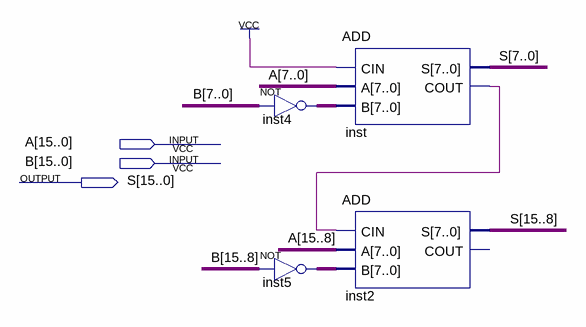
[diagram p0: schematic sheet]
// Quartus schematic SUB16bit.bdf as structural Verilog: 4 symbols, 3 pins
module SUB16bit (
  input  [15:0] A,
  input  [15:0] B,
  output [15:0] S
);

  wire inst_cout;
  wire [7:0] inst4_out, inst5_out;

  assign inst4_out = ~B[7:0];  // NOT inst4, 8 bits wide
  assign inst5_out = ~B[15:8];  // NOT inst5, 8 bits wide
  ADD inst (.CIN(1'b1), .A(A[7:0]), .B(inst4_out), .S(S[7:0]), .COUT(inst_cout));
  ADD inst2 (.CIN(inst_cout), .A(A[15:8]), .B(inst5_out), .S(S[15:8]));  // open: COUT
endmodule
